# EasyEDA schematic SCH_Base-robot_2026-06-24.json
TITLE: Sheet_1; REV: 1.0; Date: 2026-06-23; Sheet: 1/1; Company: Your Company
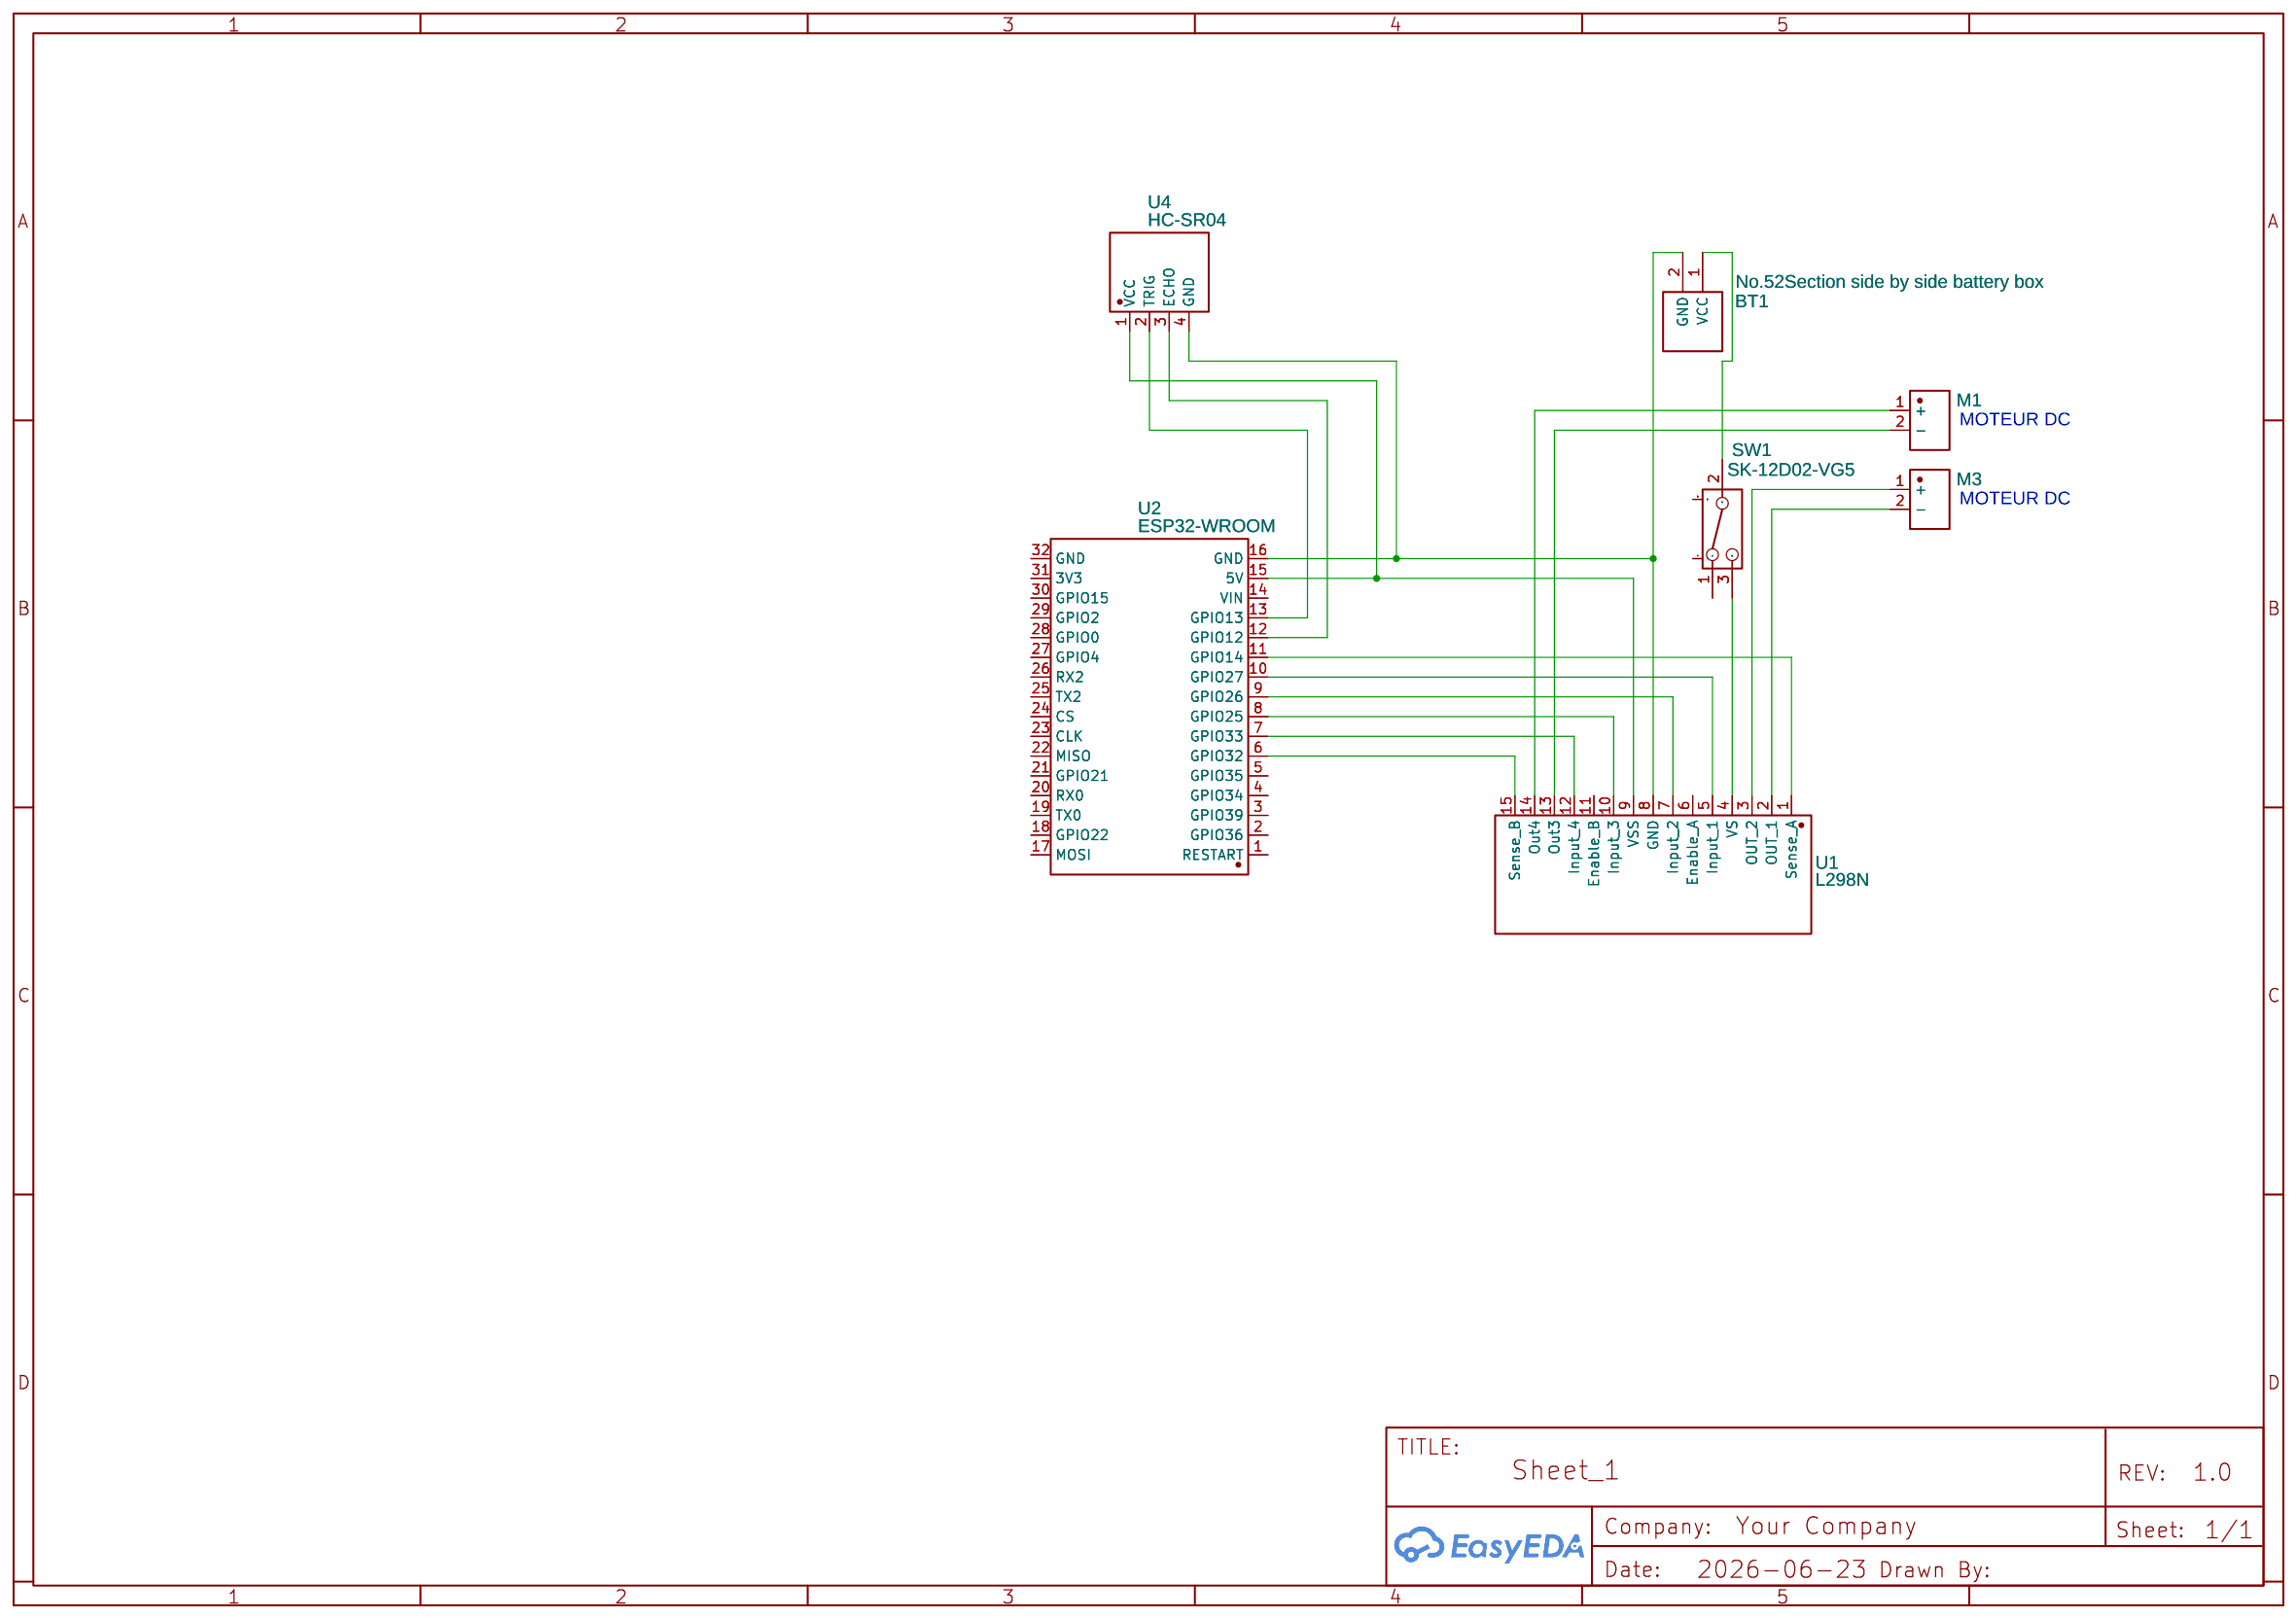
[diagram p0: schematic sheet]

## Parts
BT1  No.52Section side by side battery box  [BAT-TH_BC2AA]
M1  MOTEUR DC  [MOTOR-SMD_Z4TH3B0791626]
M3  MOTEUR DC  [MOTOR-SMD_Z4TH3B0791626]
SW1  SK-12D02-VG5  [SW-TH_SK-12D02VG3]
U1  L298N  [MULTIWATT-15_L19.6-W5.0-P1.27-L]
U2  ESP32-WROOM  [WIFI-SMD_ESP32-WROOM-32UE]
U4  HC-SR04  [TH_HC-SR04V]

## Library data of the parts
BT1 = No.52Section side by side battery box: Supplier: LCSC; Manufacturer: 国产; Manufacturer Part: 五号2节并列电池盒; Supplier Part: C5404; JLCPCB Part Class: Extended Part
M1 M3 = Z4TH3B0791626: Supplier: LCSC; Supplier Part: C2836756; Manufacturer: KOTL(金龙机电); JLCPCB Part Class: Extended Part; Contributor: lcsc
SW1 = SK-12D02-VG5: Supplier: LCSC; Supplier Part: C136722; Manufacturer: Rectangular Connectors - Contacts; Contributor: LCSC
U1 = L298N: Contributor: LCSC; Supplier: LCSC; Supplier Part: C434589; Manufacturer: HGSEMI(华冠); JLCPCB Part Class: Extended Part
U2 = ESP32-WROOM: Contributor: lcsc; Supplier: LCSC; Supplier Part: C2973674; Manufacturer: null; Manufacturer Part: ESP32-WROOM-32U(16MB); JLCPCB Part Class: Extended Part
U4 = HC-SR04: Supplier: LCSC; Supplier Part: C19857336; Manufacturer: Universal Microelectronics; Contributor: lcsc; JLCPCB Part Class: Extended Part

## Nets
Net-(BT1-1): BT1.1(VCC) SW1.2
Net-(BT1-2): BT1.2(GND) U1.8(GND) U2.16(GND) U4.4(GND)
Net-(M1-1): M1.1(+) U1.14(Out4)
Net-(M1-2): M1.2(-) U1.13(Out3)
Net-(M3-1): M3.1(+) U1.3(OUT 2)
Net-(M3-2): M3.2(-) U1.2(OUT 1)
Net-(SW1-3): SW1.3 U1.4(VS)
Net-(U1-1): U1.1(Sense A) U2.11(GPIO14)
Net-(U1-5): U1.5(Input 1) U2.10(GPIO27)
Net-(U1-7): U1.7(Input 2) U2.9(GPIO26)
Net-(U1-9): U1.9(VSS) U2.15(5V) U4.1(VCC)
Net-(U1-10): U1.10(Input 3) U2.8(GPIO25)
Net-(U1-12): U1.12(Input 4) U2.7(GPIO33)
Net-(U1-15): U1.15(Sense B) U2.6(GPIO32)
Net-(U2-12): U2.12(GPIO12) U4.3(ECHO)
Net-(U2-13): U2.13(GPIO13) U4.2(TRIG)

Not connected (* = marked no-connect by the designer): SW1 1 4 5; U1 6(Enable A) 11(Enable B); U2 1(RESTART) 2(GPIO36) 3(GPIO39) 4(GPIO34) 5(GPIO35) 14(VIN) 17(MOSI) 18(GPIO22) 19(TX0) 20(RX0) 21(GPIO21) 22(MISO) 23(CLK) 24(CS) 25(TX2) 26(RX2) 27(GPIO4) 28(GPIO0) 29(GPIO2) 30(GPIO15) 31(3V3) 32(GND)

## Notes on the sheet
- MOTEUR DC
- MOTEUR DC
